# EAGLE design SSB Transceiver_TX-RX-Switch (EAGLE 9.4.2)
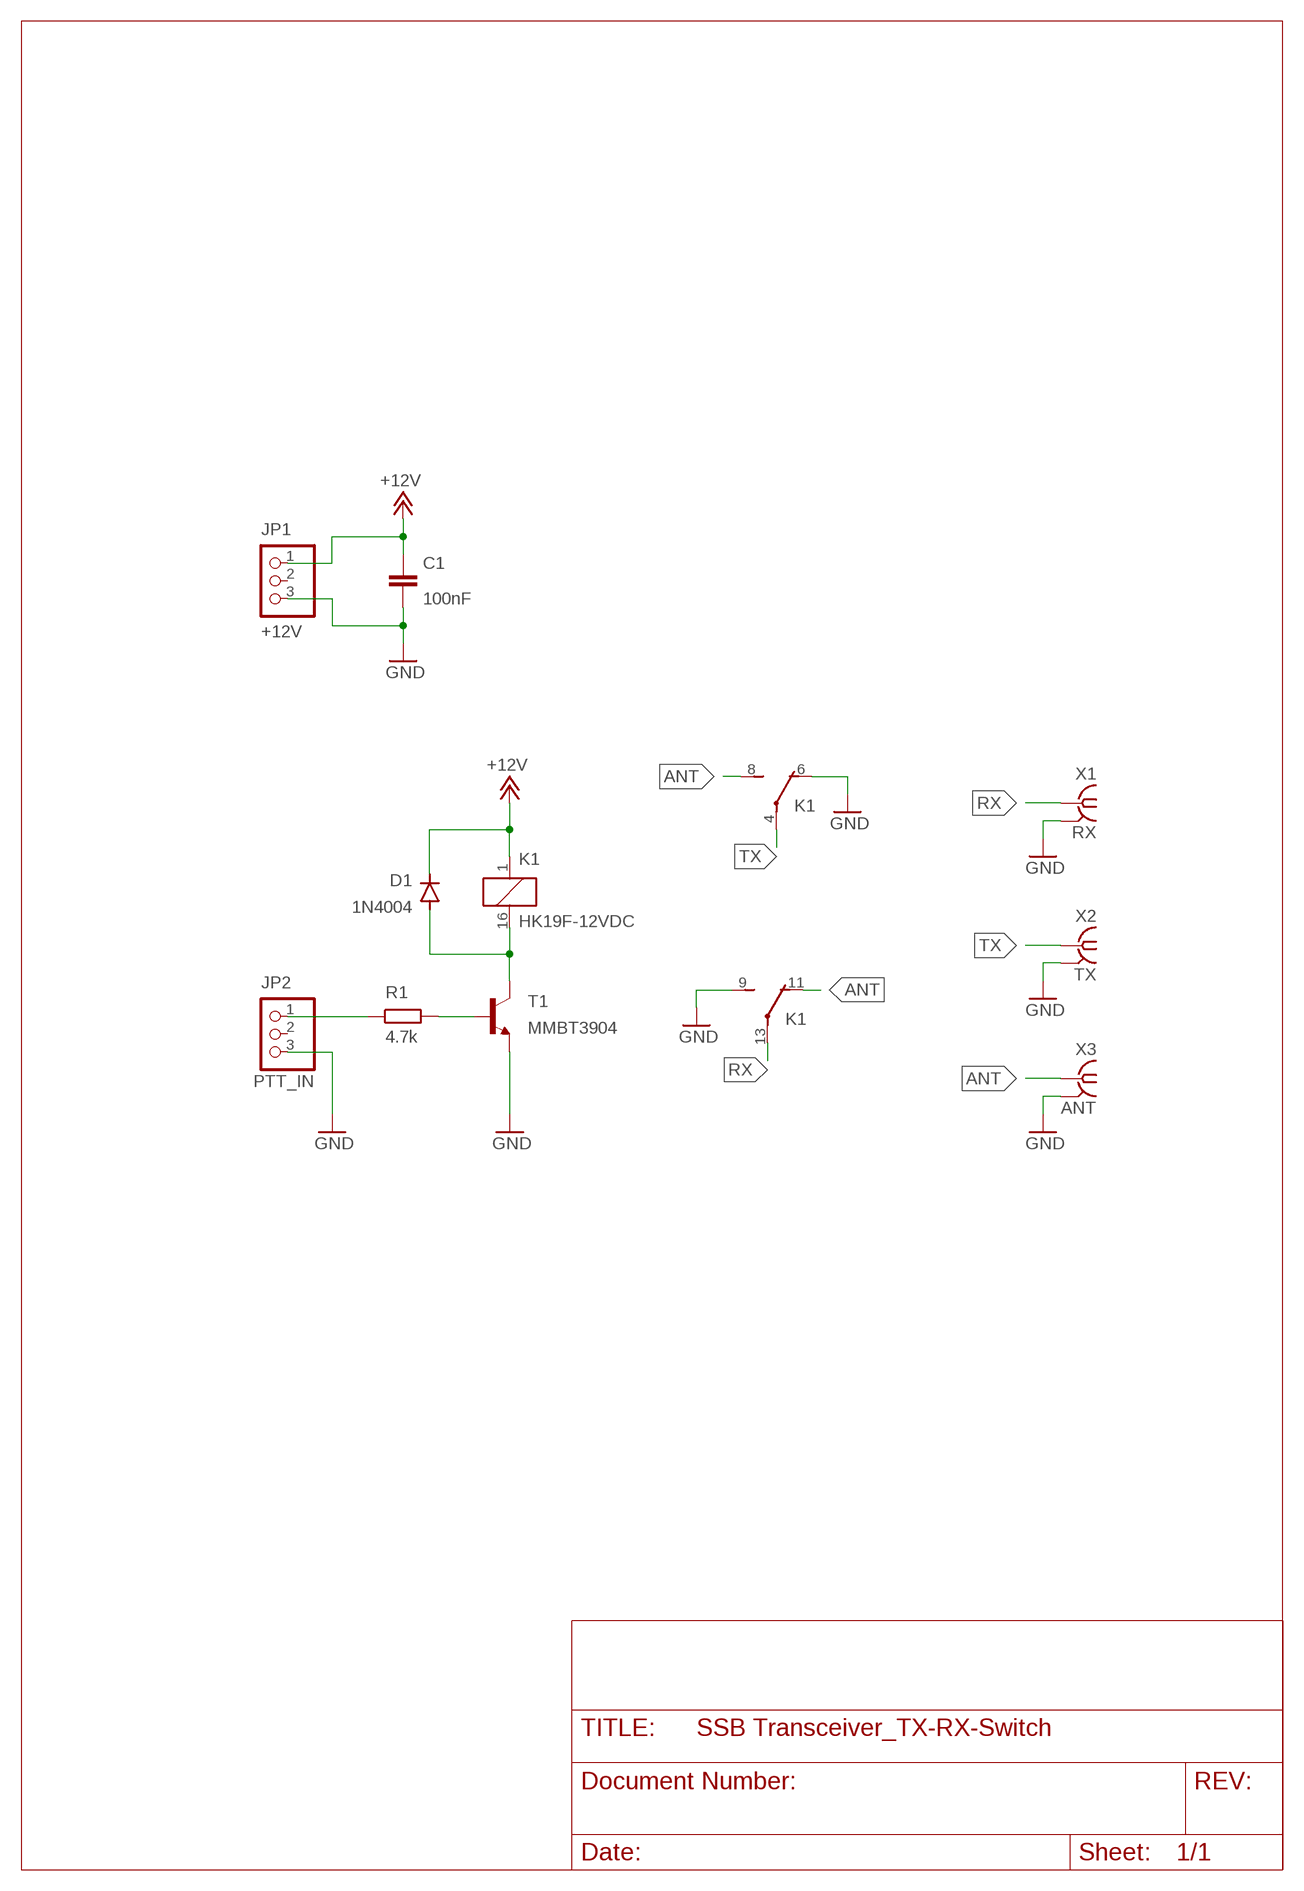
[diagram p0: schematic, sheet 1]

## Parts
C1  100nF  C-EUC0805K  [C0805K]
D1  1N4004  [DO41-10]
JP1  +12V  PINHD-1X3  [1X03]
JP2  PTT_IN  PINHD-1X3  [1X03]
K1  HK19F-12VDC  [HK19F-12VDC]
R1  4.7k  R-EU_R0805  [R0805]
T1  MMBT3904  MMBT3904LT1-NPN-SOT23-BEC  [SOT23-BEC]
X1  RX  SMA-PCB-CON  [J502-ND-142-0711-821/826_BOTTOM]
X2  TX  SMA-PCB-CON  [J502-ND-142-0711-821/826_BOTTOM]
X3  ANT  SMA-PCB-CON  [J502-ND-142-0711-821/826_BOTTOM]

## Nets
+12V: C1.1 D1.C JP1.1 K1.1(1:A)
ANT: K1.8(2:S) K1.11(O) X3.RF
GND: C1.2 JP1.3 JP2.3 K1.6(2:O) K1.9(S) T1.E X1.G@1(GND) X1.G@2(GND) X2.G@1(GND) X2.G@2(GND) X3.G@1(GND) X3.G@2(GND)
N$1: R1.2 T1.B
N$2: D1.A K1.16(1:B) T1.C
N$3: JP2.1 R1.1
RX: K1.13(P) X1.RF
TX: K1.4(2:P) X2.RF
Unconnected: JP1.2 JP2.2

## Library data of the parts
C1 = rcl:C-EU: CAPACITOR, European symbol; SPICEPREFIX: C
D1 = diode:1N4004: DIODE general purpose rectifier, 1 A
JP1 JP2 = pinhead:PINHD-1X3: PIN HEADER
K1 = Ham Radio:HK19F-12VDC: RELAY horizontal, 1 x switch, 5 A/300 V DC, 250 V AC, Siemens
R1 = rcl:R-EU_: RESISTOR, European symbol; SPICEPREFIX: R
T1 = transistor:*-NPN-: NPN Transistror BF959 corrected 2008.03.06
X1-X3 = Ham Radio:SMA-PCB-CON: SMA 50 Ohm End Launch Jack Receptacle - Round Contact Johnson Components Source: www.johnsoncomponents.com .. J502-ND.pdf

## Board
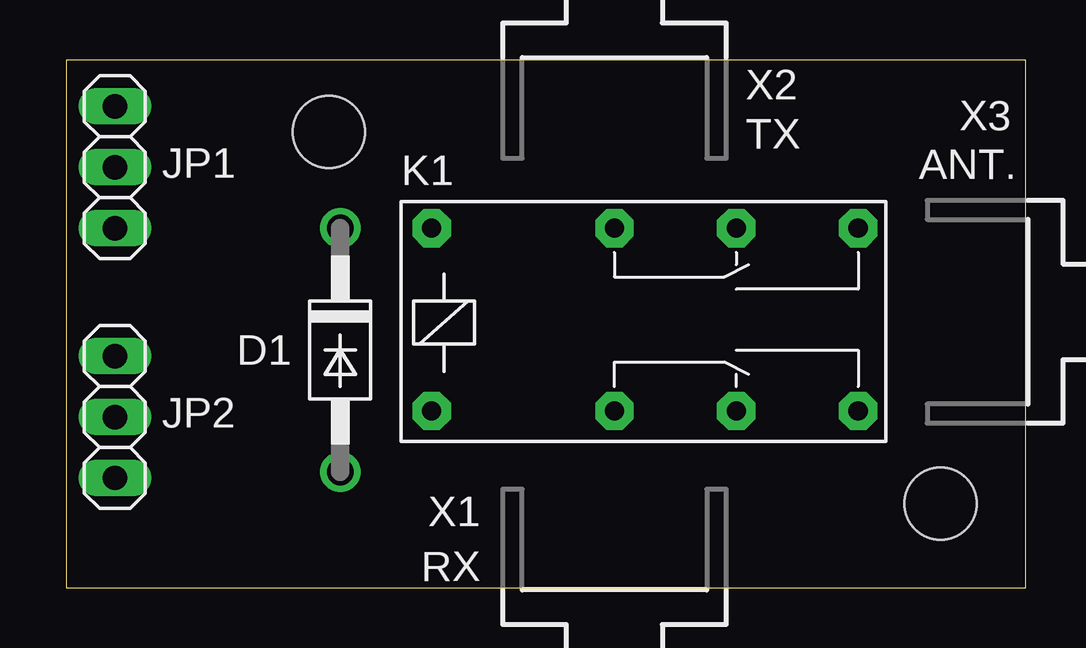
[diagram p1: board, top side]
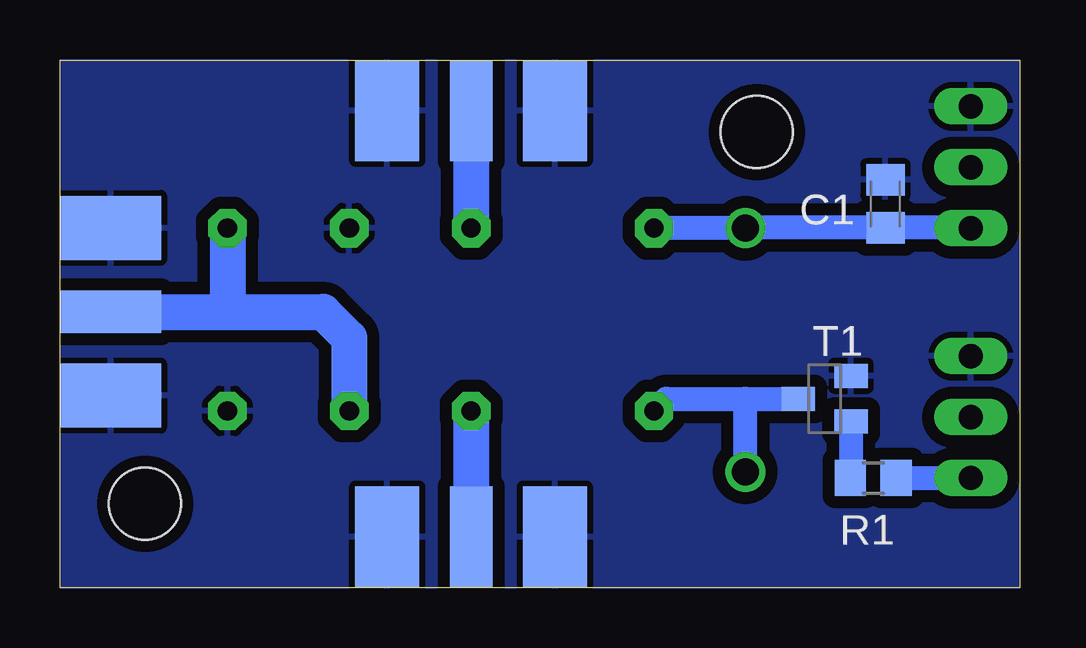
[diagram p2: board, bottom side, seen from below]

Size 40 x 22 mm. Coordinates in mm from the lower left corner, seen from the top.
Outline: 0,0 40,0 40,22 0,22 0,0
Copper layers (1*16): Top 0.035mm / dielectric 1.5mm / Bottom 0.035mm
Design rules "default *": minimum track width 6mil, minimum drill 0.35mm, track to track 20mil, track to pad 20mil, pad to pad 20mil, via to via 20mil, smd to smd 6mil, copper to edge 0mil, drill to drill 6mil, minimum pad ring 10mil, minimum via ring 8mil, stop-mask expansion 4mil, vias tented up to drill 0mil, thermal gap 10mil
Holes 3 mm at 10.95,19 36.45,3.5

### Footprints (pad centres in the part's own frame; a part is rotated, then mirrored left to right if it is on the bottom)
C0805K = smd 1.3 x 1.6: 1 -1,0; 2 1,0
DO41-10 = drill 1.118: A 5.08,0; C -5.08,0
1X03 = drill 1.016 long: 1 -2.54,0; 2 0,0; 3 2.54,0
HK19F-12VDC = drill 0.8 pad 1.6 octagon: 1 -8.382,3.556; 4 -0.762,3.556; 6 4.318,3.556; 8 9.398,3.556; 9 9.398,-4.064; 11 4.318,-4.064; 13 -0.762,-4.064; 16 -8.382,-4.064
R0805 = smd 1.3 x 1.5: 1 -0.95,0; 2 0.95,0
SOT23-BEC = smd 1 x 1.4: B -0.95,-1.1; C 0,1.1; E 0.95,-1.1
J502-ND-142-0711-821/826_BOTTOM = smd 4.191 x 2.667 bottom: G@1 2.115,3.495; G@2 2.115,-3.495 | smd 4.191 x 1.778 bottom: RF 2.115,0

### Placement (x,y rotation side)
C1  5.59,16 90 bottom
D1  11.43,9.91 270 top
JP1  2.03,17.53 90 top
JP2  2.03,7.11 90 top
K1  23.62,11.43 0 top
R1  6.1,4.57 180 bottom
T1  8.13,7.87 90 bottom
X1  22.86,0 90 top
X2  22.86,22 270 top
X3  40,11.5 180 top

### Tracks (layer width: path | path; a pad name or v marks a point on that pad's centre or on a via)
+12V
  Bottom 1: JP1.1 2.05,15 C1.1 11.41,15 D1.C K1.1
ANT
  Bottom 1.5: X3.RF 33.02,11.5 | 33.02,11.5 29.03,11.5 27.94,10.41 K1.11 | K1.8 33.02,11.5
GND
  pour Bottom (isolate 0.5): 0,0 0,22 40,22 40,0
N$1
  Bottom 1: T1.B 7.03,4.59 R1.2
N$2
  Bottom 1: K1.16 14.73,7.87 11.43,7.87 | 11.43,7.87 T1.C | D1.A 11.43,7.87
N$3
  Bottom 1: R1.1 JP2.1
RX
  Bottom 1.5: K1.13 X1.RF
TX
  Bottom 1.5: X2.RF K1.4

### Text on the board
tNames: TX | ANT. | RX